# Altium schematic sheet 02_nRF52840.SchDoc
size 420 x 297 mm; Address1: Address1; Address2: Address2; Address3: Address3; Address4: Address4; DocumentNumber: АБВГ.123456.001 Э3; SheetNumber: 1; Scale: 1:1; DocumentType: Схема электрическая принципиальная; FirstReferrence: АБВГ.123456.001
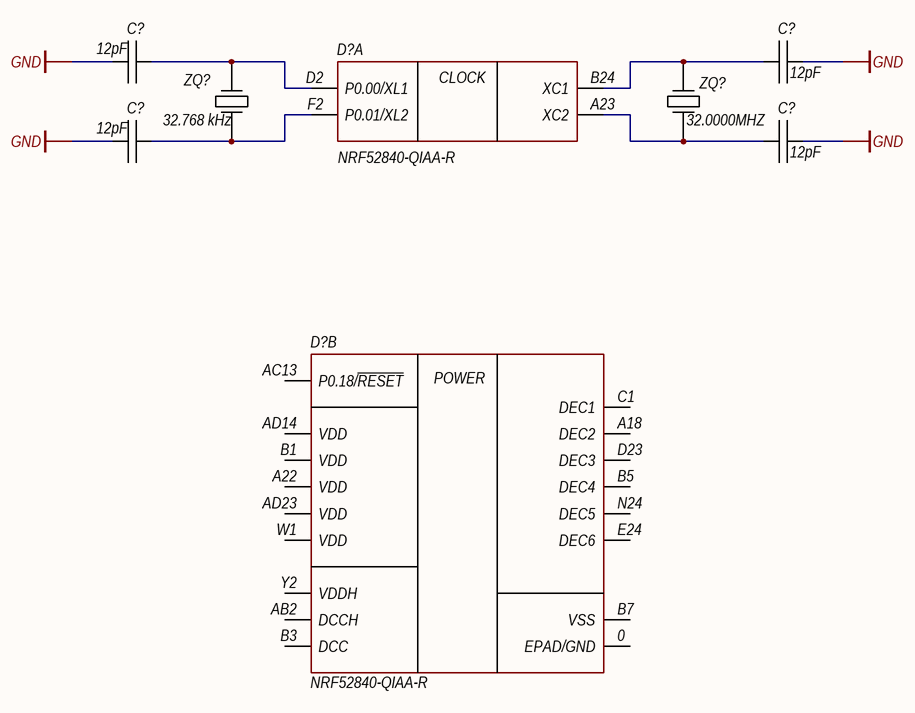
[diagram p0: 02_nRF52840.SchDoc]

## Parts
(Parts that share a designator on the sheet are numbered #1, #2 ... from top to bottom, then left to right.)
C?#1  12pF  [CAPC1608X09N]
C?#2  12pF  [CAPC1608X09N]
C?#3  12pF  [CAPC1608X09N]
C?#4  12pF  [CAPC1608X09N]
D?#1  NRF52840-QIAA-R  [AQFN50P700X700X85_HS-74N]  (part A of 9)
D?#2  NRF52840-QIAA-R  [AQFN50P700X700X85_HS-74N]  (part B of 9)
ZQ?#1  32.768 kHz  [ECX-16]
ZQ?#2  32.0000MHZ  [ABM11W-32.0000MHZ-8-D1X-T3]

## Nets
GND: C?#1.1 C?#2.2 C?#3.1 C?#4.2 ZQ?#2.2 ZQ?#2.4
NetC?#1_2: C?#1.2 D?#1.D2(P0.00/XL1) ZQ?#1.2
NetC?#2_1: C?#2.1 D?#1.B24(XC1) ZQ?#2.3
NetC?#3_2: C?#3.2 D?#1.F2(P0.01/XL2) ZQ?#1.1
NetC?#4_1: C?#4.1 D?#1.A23(XC2) ZQ?#2.1

Not connected (* = marked no-connect by the designer): D?#2 0(EPAD/GND) A18(DEC2) A22(VDD) AB2(DCCH) AC13(P0.18/~{RESET}) AD14(VDD) AD23(VDD) B1(VDD) B3(DCC) B5(DEC4) B7(VSS) C1(DEC1) D23(DEC3) E24(DEC6) N24(DEC5) W1(VDD) Y2(VDDH)

## Notes on the sheet
- Author
- Manufacturer
- Date
- Page
- Total pages
- Size page
- A3
- Materials
- (in symbol nRF52840-QFN373, part A) CLOCK
- (in symbol nRF52840-QFN373, part B) POWER

## Library data of the parts
C?#1-C?#4 = Ceramic: Ceramic capacitor; Manufacturer: Yageo; Mfr. Part Number: CC0603JRNPO9BN120; Power/Voltage: 50V; Tolerance: 5%; Operation Temperature: -55...+125; Help URL: https://www.digikey.com/en/products/detail/yageo/CC0603JRNPO9BN120/302793; Type: capacitor; Value: 12pF; Note: *; Case: 0603
D?#1 D?#2 = nRF52840-QFN373: IC RF TxRx + MCU 802.15.4, Bluetooth Bluetooth v5.0 2.4GHz 73-VFQFN Dual Rows, Exposed Pad; Manufacturer: Nordic Semiconductor ASA; Power/Voltage: 1.7V ~ 5.5V; Operation Temperature: -40...+85; Help URL: https://www.digikey.com/en/products/detail/nexperia-usa-inc/2N7002-215/762973; Type: IC RF TXRX+MCU 802.15.4; Value: *; Tolerance: *; Note: *; Case: 73-aQFN (7x7); PartNumber: NRF52840-QIAA-R
ZQ?#1 = ECS-.327-9-16-TR: CRYSTAL 32.7680KHZ 9PF SMD ±20ppm Crystal 9pF 2-SMD, No Lead; Manufacturer: ECS Inc.; Operation Temperature: -40...+85; Mfg. Part Number: ECS-.327-9-16-TR; Help URL: https://www.digikey.com/en/products/detail/ecs-inc/ECS-327-9-16-TR/5875558; Power/Voltage: *; Type: crystal oscillator, tunning fork; Value: 32.768 kHz; Tolerance: 20ppm; Note: *; Case: 2-SMD, No Lead
ZQ?#2 = ABM11W-32.0000MHZ-8-D1X-T3: CRYSTAL 32.0000MHZ 8PF SMD, ±10ppm Crystal 8pF 4-SMD, No Lead; Manufacturer: Abracon LLC; Operation Temperature: -40...+85; Mfg. Part Number: ABM11W-32.0000MHZ-8-D1X-T3; Help URL: https://www.digikey.com/en/products/detail/abracon-llc/ABM11W-32-0000MHZ-8-D1X-T3/7172671; Power/Voltage: *; Type: crystal oscillator; Value: 32.0000MHZ; Tolerance: 10ppm; Note: *; Case: 4-SMD, No Lead